# EasyEDA Pro project PicoUSBMotherboardV3.1.eprj, schematic Schematic1
Board Name: Board1; Create Date: 2026-05-29; Page Name: P1; Project Name: PicoUSBMotherboardV3.0; Schematic Name: Schematic1; Update Date: 2026-08-03; Company: EasyEDA.com; Drawn: EasyEDA; Page Size: A4; Part Number: JLCPCB-002; Reviewed: EasyEDA; Version: V0.1
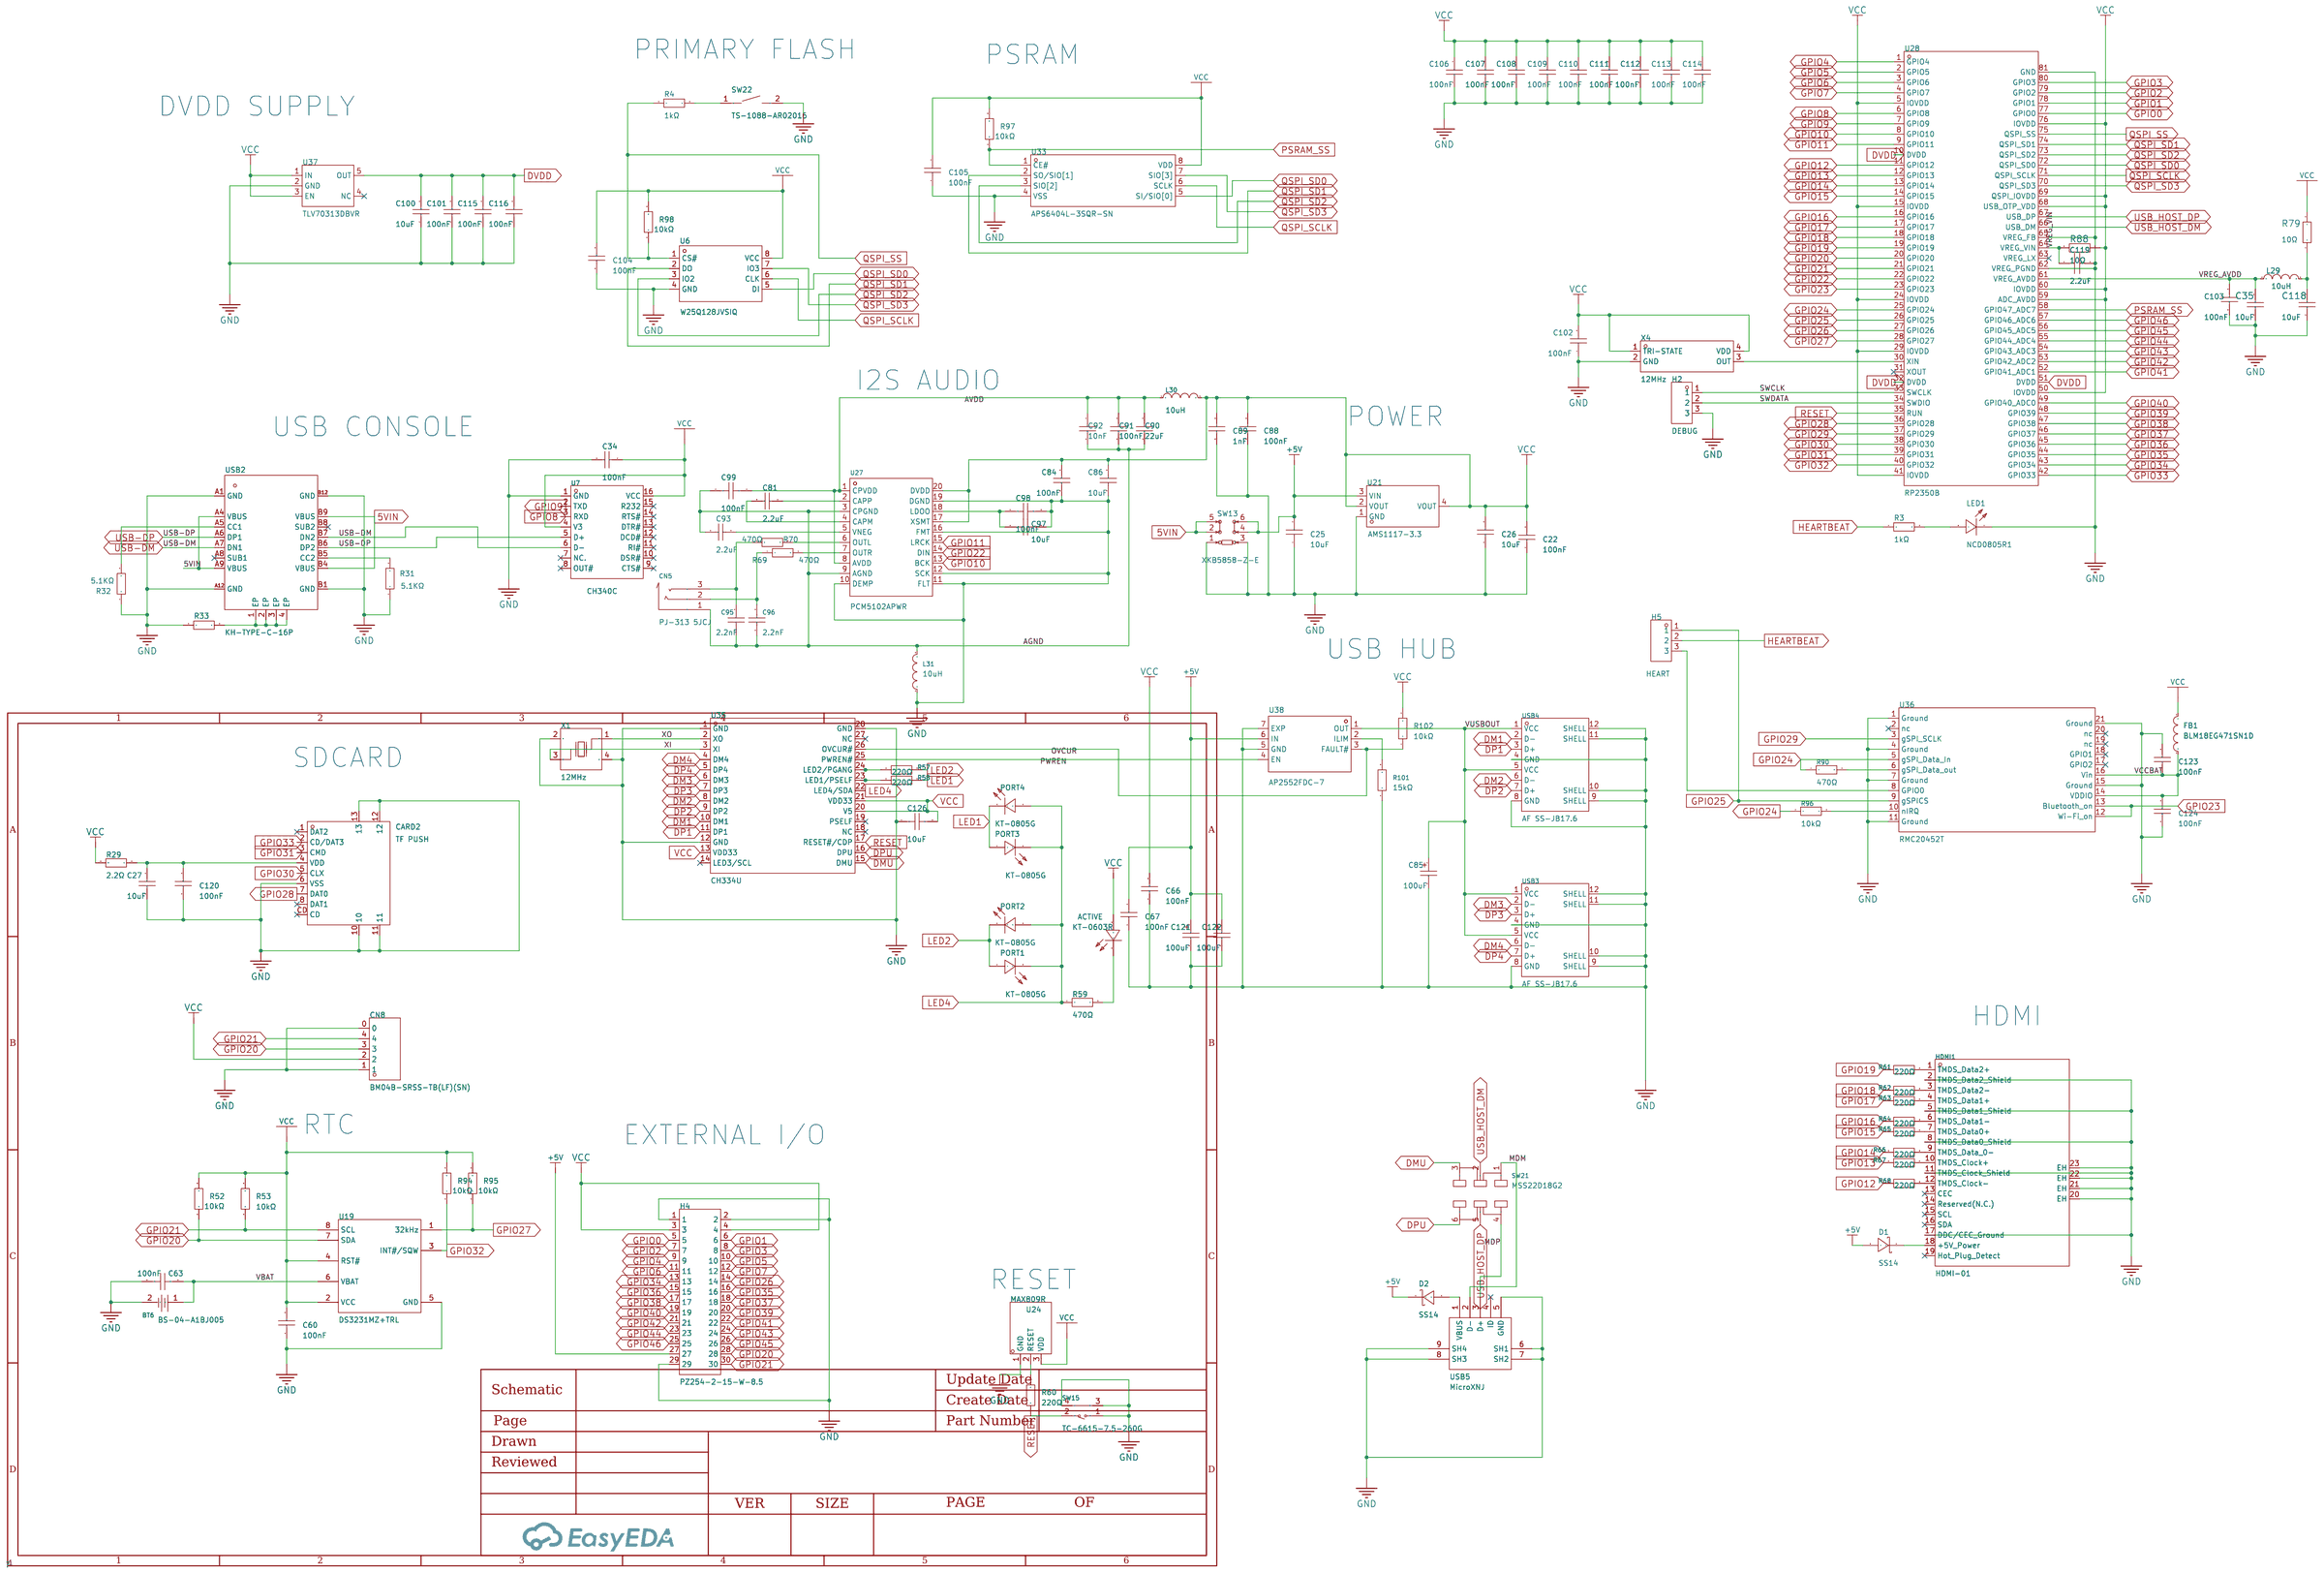
[diagram p0: schematic sheet]

## Parts
ACTIVE  KT-0603R  [LED0603-RD]
BT6  BS-04-A1BJ005  [BAT-TH_BS-04-A1BJ004]
C22  100nF  [C0402_NEW]
C25  10uF  [C1206]
C26  10uF  [C1206]
C27  10uF  [C1206]
C34  100nF  [C0402_NEW]
C35  10uF  [C1206]
C60  100nF  [C0402_NEW]
C63  100nF  [C0402]
C66  100nF  [C0402_NEW]
C67  100nF  [C0402_NEW]
C81  2.2uF  [C0603]
C84  100nF  [C0402_NEW]
C85  100uF  [CASE-B_3528]
C86  10uF  [C1206]
C88  100nF  [C0402_NEW]
C89  1nF  [C0805]
C90  22uF  [C1206]
C91  100nF  [C0402_NEW]
C92  10nF  [C0805]
C93  2.2uF  [C0603]
C95  2.2nF  [C0805]
C96  2.2nF  [C0805]
C97  10uF  [C0805]
C98  100nF  [C0805]
C99  100nF  [C0805]
C100  10uF  [C1206]
C101  100nF  [C0402_NEW]
C102  100nF  [C0402_NEW]
C103  100nF  [C0402_NEW]
C104  100nF  [C0805]
C105  100nF  [C0402_NEW]
C106  100nF  [C0402_NEW]
C107  100nF  [C0402_NEW]
C108  100nF  [C0402_NEW]
C109  100nF  [C0402_NEW]
C110  100nF  [C0402_NEW]
C111  100nF  [C0402_NEW]
C112  100nF  [C0402_NEW]
C113  100nF  [C0402_NEW]
C114  100nF  [C0402_NEW]
C115  100nF  [C0402_NEW]
C116  100nF  [C0402_NEW]
C118  10uF  [C1206]
C119  2.2uF  [C0402]
C120  100nF  [C0805]
C121  100uF  [CASE-B_3528]
C122  100uF  [CASE-B_3528]
C123  100nF  [C0402_NEW]
C124  100nF  [C0402_NEW]
C126  10uF  [C0603]
CARD2  TF PUSH  [TF-SMD_TF-PUSH]
CN5  PJ-313 5JCJ  [AUDIO-TH_PJ-313_5JCJ]
CN8  BM04B-SRSS-TB(LF)(SN)  [CONN-SMD_BM04B-SRSS-TB]
D1  SS14  [SMA_L4.2-W2.6-LS5.3-RD]
D2  SS14  [SMA_L4.2-W2.6-LS5.3-RD]
FB1  BLM18EG471SN1D  [L0603]
H2  DEBUG  [HDR-TH_3P-P2.54-V-M]
H4  PZ254-2-15-W-8.5  [HDR-TH_30P-P2.54-H-M-R2-C15-S2.54-N]
H5  HEART  [HDR-TH_3P-P2.54-V-M]
HDMI1  HDMI-01  [USB-SMD_HDMI-01]
L29  10uH  [L0805]
L30  10uH  [L0805]
L31  10uH  [L0805]
LED1  NCD0805R1  [LED0805-RD]
PORT1  KT-0805G  [LED0805-R-RD]
PORT2  KT-0805G  [LED0805-R-RD]
PORT3  KT-0805G  [LED0805-R-RD]
PORT4  KT-0805G  [LED0805-R-RD]
R3  1kΩ  [R0603]
R4  1kΩ  [R0603]
R29  2.2Ω  [R0805]
R31  5.1kΩ  [R0402]
R32  5.1kΩ  [R0402]
R33  1MΩ  [R0402]
R52  10kΩ  [R0805]
R53  10kΩ  [R0805]
R57  220Ω  [R0805]
R58  220Ω  [R0805]
R59  470Ω  [R0603]
R60  220Ω  [R0603]
R61  220Ω  [R0603]
R62  220Ω  [R0603]
R63  220Ω  [R0603]
R64  220Ω  [R0603]
R65  220Ω  [R0603]
R66  220Ω  [R0603]
R67  220Ω  [R0603]
R68  220Ω  [R0603]
R69  470Ω  [R0603]
R70  470Ω  [R0603]
R79  10Ω  [R0805_NEW]
R88  10Ω  [R0805_NEW]
R90  470Ω  [R0402]
R94  10kΩ  [R0805]
R95  10kΩ  [R0805]
R96  10kΩ  [R0603]
R97  10kΩ  [R0805]
R98  10kΩ  [R0805]
R101  15kΩ  [R0402]
R102  10kΩ  [R0805]
SW13  XKB5858-Z-E  [SW-TH_XKB5858-Z-E]
SW15  TC-6615-7.5-260G  [SW-TH_4P-L7.5-W7.5-P4.50]
SW21  MSS22D18G2  [SW-TH_MSS22D18GX]
SW22  TS-1088-AR02016  [SW-SMD_L3.9-W3.0-P4.45]
U6  W25Q128JVSIQ  [SOIC-8_L5.3-W5.3-P1.27-LS8.0-BL]
U7  CH340C  [SOP-16_L10.0-W3.9-P1.27-LS6.0-BL]
U19  DS3231MZ+TRL  [SOIC-8_L4.9-W3.9-P1.27-LS6.0-BL]
U21  AMS1117-3.3  [SOT-223-3_L6.5-W3.4-P2.30-LS7.0-BR]
U24  MAX809R  [SOT-23-3_L2.9-W1.3-P1.90-LS2.4-BR]
U27  PCM5102APWR  [TSSOP-20_L6.5-W4.4-P0.65-LS6.4-BL]
U28  RP2350B  [QFN-80_L10.0-W10.0-P0.40-TL-EP3.4]
U33  APS6404L-3SQR-SN  [SOIC-8_L4.9-W3.9-P1.27-LS6.0-BL]
U35  CH334U  [QSOP-28_L9.9-W3.9-P0.64-LS6.0-BL]
U36  RMC20452T  [WIRELM-SMD_RMC20452T]
U37  TLV70313DBVR  [SOT-23-5_L3.0-W1.5-P0.95-LS2.8-BL]
U38  AP2552FDC-7  [WDFN-6_L2.0-W2.0-P0.65-BL-EP-1]
USB2  KH-TYPE-C-16P  [USB-C-SMD_KH-TYPE-C-16P]
USB3  AF SS-JB17.6  [USB-A-TH_AF-SS-JB17.6]
USB4  AF SS-JB17.6  [USB-A-TH_AF-SS-JB17.6]
USB5  MicroXNJ  [MICRO-USB-SMD_MICROXNJ]
X1  12MHz  [OSC-SMD_4P-L3.2-W2.5-BL]
X4  12MHz  [OSC-SMD_4P-L3.2-W2.5-BL]

## Library data of the parts
ACTIVE = KT-0603R: Emitted Color:Red Power Dissipation:- Forward Current:- Dominant Wavelength:- Dominant Wavelength:- Peak Wavelength:- Diode Configuration:- Lens Color:- Color Temperature:- Color Temperature:- Viewing Angle:- Mounting Sytle:- Operating Temperature:-40℃~+8; LCSC Part Name: 0603 红灯 高亮; Supplier Part: C2286; Manufacturer: KENTO; Supplier Footprint: 0603; JLCPCB Part Class: Basic Part; Datasheet: https://atta.szlcsc.com/upload/public/pdf/source/20160616/1466072038404.pdf; Supplier: LCSC; Emitted Color: Red; Operating Temperature: -40℃~+85℃
BT6 = BS-04-A1BJ005: Connector Type:Battery base Battery Type:CR2032 Operating Temperature Range:-25℃~+85℃ Operating Temperature Range:-25℃~+85℃; LCSC Part Name: 电池底座 适用电池:CR2032; Supplier Part: C964751; Manufacturer: MYOUNG(美阳); Supplier Footprint: 插件; JLCPCB Part Class: Extended Part; Datasheet: https://atta.szlcsc.com/upload/public/pdf/source/20201218/C964751_974D973689E162B6ACD63DB51B9F9202.pdf; Supplier: LCSC; Connector Type: Battery base; Battery Type: CR2032; Operating Temperature Range: -25℃~+85℃
C22 C34 C60 C66 C67 C84 C88 C91 C101-C103 C105-C116 C123 C124 = CL05B104KO5NNNC: Capacitance: Tolerance:±10% Tolerance:±10% Voltage Rated: Temperature Coefficient:; LCSC Part Name: 100nF ±10% 16V; Supplier Part: C1525; Manufacturer: SAMSUNG(三星); Supplier Footprint: 0402; JLCPCB Part Class: Basic Part; Datasheet: https://atta.szlcsc.com/upload/public/pdf/source/20160103/1457707674891.pdf; Supplier: LCSC; Tolerance: ±10%
C25-C27 C35 C86 C100 C118 = CL31A106KBHNNNE: Capacitance: Tolerance:±10% Tolerance:±10% Voltage Rated: Temperature Coefficient:; LCSC Part Name: 10uF ±10% 50V; Supplier Part: C13585; Manufacturer: SAMSUNG(三星); Supplier Footprint: 1206; JLCPCB Part Class: Basic Part; Datasheet: https://atta.szlcsc.com/upload/public/pdf/source/20160103/1457707668742.pdf; Supplier: LCSC; Tolerance: ±10%
C63 = CL05B104KB54PNC: Capacitance: Tolerance:±10% Tolerance:±10% Voltage Rated: Temperature Coefficient:; LCSC Part Name: 100nF ±10% 50V; Supplier Part: C307331; Manufacturer: SAMSUNG(三星); Supplier Footprint: 0402; JLCPCB Part Class: Basic Part; Datasheet: https://atta.szlcsc.com/upload/public/pdf/source/20160218/1457707763339.pdf; Supplier: LCSC; Tolerance: ±10%
C81 C93 = CL10A225KO8NNNC: Capacitance: Tolerance:±10% Tolerance:±10% Voltage Rated: Temperature Coefficient:; LCSC Part Name: 2.2uF ±10% 16V; Supplier Part: C23630; Manufacturer: SAMSUNG(三星); Supplier Footprint: 0603; JLCPCB Part Class: Basic Part; Datasheet: https://atta.szlcsc.com/upload/public/pdf/source/20160218/1457707763339.pdf; Supplier: LCSC; Tolerance: ±10%
C85 C121 C122 = TAJB107K006RNJ: Capacitance: Tolerance:±10% Tolerance:±10% Rated Voltage: Equivalent Series Resistance(ESR):1.7Ω@100kHz Operating Temperature:-55℃~+125℃ Operating Temperature:-55℃~+125℃; LCSC Part Name: 100uF ±10% 6.3V; Supplier Part: C16133; Manufacturer: Kyocera AVX; Supplier Footprint: CASE-B-3528-21(mm); JLCPCB Part Class: Basic Part; Datasheet: https://atta.szlcsc.com/upload/public/pdf/source/20160107/1457707750344.pdf; Supplier: LCSC; Tolerance: ±10%; Equivalent Series Resistance(ESR): 1.7Ω@100kHz; Operating Temperature: -55℃~+125℃
C89 = CL21B102KBCNNNC: Capacitance: Tolerance:±10% Tolerance:±10% Voltage Rated: Temperature Coefficient:; LCSC Part Name: 1nF ±10% 50V; Supplier Part: C46653; Manufacturer: SAMSUNG(三星); Supplier Footprint: 0805; JLCPCB Part Class: Basic Part; Datasheet: https://atta.szlcsc.com/upload/public/pdf/source/20160218/1457707763339.pdf; Supplier: LCSC; Tolerance: ±10%
C90 = CL31A226KAHNNNE: Capacitance: Tolerance:±10% Tolerance:±10% Voltage Rated: Temperature Coefficient:; LCSC Part Name: 22uF ±10% 25V; Supplier Part: C12891; Manufacturer: SAMSUNG(三星); Supplier Footprint: 1206; JLCPCB Part Class: Basic Part; Datasheet: https://atta.szlcsc.com/upload/public/pdf/source/20160218/1457707763339.pdf; Supplier: LCSC; Tolerance: ±10%
C92 = CL21B103KBANNNC: Capacitance: Tolerance:±10% Tolerance:±10% Voltage Rated: Temperature Coefficient:; LCSC Part Name: 10nF ±10% 50V; Supplier Part: C1710; Manufacturer: SAMSUNG(三星); Supplier Footprint: 0805; JLCPCB Part Class: Basic Part; Datasheet: https://atta.szlcsc.com/upload/public/pdf/source/20160218/1457707763339.pdf; Supplier: LCSC; Tolerance: ±10%
C95 C96 = CL21C222JBFNNNE: Capacitance: Tolerance:±5% Tolerance:±5% Voltage Rated: Temperature Coefficient:; LCSC Part Name: 2.2nF ±5% 50V; Supplier Part: C28260; Manufacturer: SAMSUNG(三星); Supplier Footprint: 0805; JLCPCB Part Class: Basic Part; Datasheet: https://atta.szlcsc.com/upload/public/pdf/source/20160218/1457707763339.pdf; Supplier: LCSC; Tolerance: ±5%
C97 = CL21A106KAYNNNE_C15850: Capacitance: Tolerance:±10% Tolerance:±10% Voltage Rated: Temperature Coefficient:; LCSC Part Name: 10uF ±10% 25V; Supplier Part: C15850; Manufacturer: SAMSUNG(三星); Manufacturer Part: CL21A106KAYNNNE; Supplier Footprint: 0805; JLCPCB Part Class: Basic Part; Datasheet: https://atta.szlcsc.com/upload/public/pdf/source/20160218/1457707763339.pdf; Supplier: LCSC; Tolerance: ±10%
C98 C99 = CC0805KRX7R9BB104: Capacitance: Tolerance:±10% Tolerance:±10% Voltage Rated: Temperature Coefficient:; LCSC Part Name: 100nF ±10% 50V; Supplier Part: C49678; Manufacturer: YAGEO(国巨); Supplier Footprint: 0805; JLCPCB Part Class: Basic Part; Datasheet: https://atta.szlcsc.com/upload/public/pdf/source/20180224/C181747_15194369449651363981.pdf; Supplier: LCSC; Tolerance: ±10%
C104 C120 = CL21B104KCFNNNE: Capacitance: Tolerance:±10% Tolerance:±10% Voltage Rated: Temperature Coefficient:; LCSC Part Name: 100nF ±10% 100V; Supplier Part: C28233; Manufacturer: SAMSUNG(三星); Supplier Footprint: 0805; JLCPCB Part Class: Basic Part; Datasheet: https://atta.szlcsc.com/upload/public/pdf/source/20160218/1457707763339.pdf; Supplier: LCSC; Tolerance: ±10%
C119 = CL05A225MQ5NSNC: Capacitance: Tolerance:±20% Tolerance:±20% Voltage Rated: Temperature Coefficient:; LCSC Part Name: 2.2uF ±20% 6.3V; Supplier Part: C12530; Manufacturer: SAMSUNG(三星); Supplier Footprint: 0402; JLCPCB Part Class: Basic Part; Datasheet: https://atta.szlcsc.com/upload/public/pdf/source/20160218/1457707763339.pdf; Supplier: LCSC; Tolerance: ±20%
C126 = CL10A106KP8NNNC: LCSC Part Name: 10uF ±10% 10V; Supplier Part: C19702; Manufacturer: SAMSUNG(三星); Supplier Footprint: 0603; JLCPCB Part Class: Basic Part; Datasheet: https://item.szlcsc.com/datasheet/CL10A106KP8NNNC/20411.html; Supplier: LCSC; Tolerance: ±10%; Voltage Rating: 10V; Temperature Coefficient: X5R
CARD2 = TF PUSH: Card Type:MicroSD卡(TF卡) Connector Type:卡座 Card Connection Mode:自弹式 Maximum Body Height:2mm Operating Temperature Range:-20℃~+90℃ Operating Temperature Range:-20℃~+90℃; LCSC Part Name: 自弹式TF卡座 TF外焊式内存卡卡座; Supplier Part: C393941; Manufacturer: SHOU HAN(首韩); Supplier Footprint: SMD; JLCPCB Part Class: Extended Part; Datasheet: https://atta.szlcsc.com/upload/public/pdf/source/20191011/C393941_0DDD896EE907FEB750D8B7B8982E2A67.pdf; Supplier: LCSC; Card Type: MicroSD卡(TF卡); Connector Type: 卡座; Card Connection Mode: 自弹式; Maximum Body Height: 2mm; Operating Temperature Range: -20℃~+90℃
CN5 = PJ-313 5JCJ: Connector Type:3.5mm耳机座 Current Rating (Max):- Voltage Rating (Max):- Operating Temperature Range:-20℃~+70℃ Operating Temperature Range:-20℃~+70℃; LCSC Part Name: 3.5mm耳机座; Supplier Part: C668607; Manufacturer: SHOU HAN(首韩); Supplier Footprint: 插件; JLCPCB Part Class: Extended Part; Datasheet: https://atta.szlcsc.com/upload/public/pdf/source/20200618/C668607_FE17687B176711313D54B567644D1F03.pdf; Supplier: LCSC; Connector Type: 3.5mm耳机座; Operating Temperature Range: -20℃~+70℃
CN8 = BM04B-SRSS-TB(LF)(SN): Pins Structure:1x4P Pitch:1mm Mounting Style:Standing paste Reference Series:SH Number of Pins:4P Number of Rows:1 Number of PINs Per Row:4 Row Spacing:- Current Rating (Max):1A Contact Material:Copper alloy Contact Plating:Tin Operating Temperature Range; LCSC Part Name: 1x4P 间距:1mm 立贴 系列:SH; Supplier Part: C160390; Manufacturer: JST; Supplier Footprint: SMD,P=1mm; JLCPCB Part Class: Extended Part; Datasheet: https://atta.szlcsc.com/upload/public/pdf/source/20181008/C268118_5C0FE2784716D1E5DD0A36233D1E1F34.pdf; Supplier: LCSC; Pins Structure: 1x4P; Pitch: 1mm; Mounting Style: Standing paste; Reference Series: SH; Number of Pins: 4P; Number of Rows: 1; Number of PINs Per Row: 4; Current Rating (Max): 1A; Contact Material: Copper alloy; Contact Plating: Tin; Operating Temperature Range: -25℃~+85℃; Rated Voltage (Max): 50V; Plastic Material: PA; Flame Retardant Rating: UL94V-0; Supplementary Features: Auxiliary soldering legs; Colour: White; Z-Height of the Board: 4.25mm; X-Length of Bottom Edge on Board (Spacing Line): 6mm; Y-Width of Bottom Edge on Board: 3.6mm
D1 D2 = SS14_C2480: Diode Configuration:Single Forward Voltage (Vf@If):550mV@1A Reverse Voltage (Vr):40V Rectified Current:1A Reverse Leakage Current (Ir):300uA@40V; LCSC Part Name: 电压:40V 电流:1A; Supplier Part: C2480; Manufacturer: MDD(辰达半导体); Supplier Footprint: SMA(DO-214AC); JLCPCB Part Class: Basic Part; Datasheet: https://atta.szlcsc.com/upload/public/pdf/source/20230712/2DB6064CFBB99DE6DB116BEE8208BE66.pdf; Supplier: LCSC; Diode Configuration: Single; Forward Voltage (Vf@If): 550mV@1A; Reverse Voltage (Vr): 40V; Rectified Current: 1A; Reverse Leakage Current (Ir): 300uA@40V
FB1 = BLM18EG471SN1D: Impedance @ Frequency:470Ω@100MHz Tolerance:±25% Tolerance:±25% DC Resistance(DCR):210mΩ Current Rating:500mA Number of Circuits:1 Operating Temperature:-55℃~+125℃ Operating Temperature:-55℃~+125℃; LCSC Part Name: 单路 0603磁珠 阻抗470Ω@100MHz; Supplier Part: C337880; Manufacturer: muRata(村田); Supplier Footprint: 0603; JLCPCB Part Class: Extended Part; Datasheet: https://item.szlcsc.com/datasheet/BLM18EG471SN1D/315660.html; Supplier: LCSC; Impedance @ Frequency: 470Ω@100MHz; Tolerance: ±25%; DC Resistance(DCR): 210mΩ; Current Rating: 500mA; Number of Circuits: 1; Operating Temperature: -55℃~+125℃
H2 H5 = PZ254V-11-03P: Pin Structure:1x3P Pitch:2.54mm Row Spacing:- Circluar Pins/Square Pins:Policy Mounting Type:Direct Insert Number of Rows:Single Row Number of Pins:3P Current Rating (Max):3A Voltage Rating (Max):250V Length of Mating Pin:6mm Insulation Height:2.5mm Lengt; LCSC Part Name: 间距:2.54mm 1x3P 直插 方针; Supplier Part: C2937625; Manufacturer: XFCN(兴飞); Supplier Footprint: 插件,P=2.54mm; JLCPCB Part Class: Extended Part; Datasheet: https://atta.szlcsc.com/upload/public/pdf/source/20200309/C492402_8335C3D49C4E4C618838D59BB1D024C1.pdf; Supplier: LCSC; Pin Structure: 1x3P; Pitch: 2.54mm; Circluar Pins/Square Pins: Policy; Mounting Type: Direct Insert; Number of Rows: Single Row; Number of Pins: 3P; Current Rating (Max): 3A; Voltage Rating (Max): 250V; Length of Mating Pin: 6mm; Insulation Height: 2.5mm; Length of End Connection Pin: 3mm; Operating Temperature Range: -40℃~+105℃; Color: Black
H4 = PZ254-2-15-W-8.5: Pin Structure:2x15P Pitch:2.54mm Row Spacing:2.54mm Circluar Pins/Square Pins:Policy Mounting Type:Right-Angle Number of Rows:Double Row Number of Pins:30P Current Rating:3A Voltage Rating (Max):- Length of Mating Pin:6mm Insulation Height:2.5mm Length of; LCSC Part Name: 2x15P 间距:2.54mm 方针 弯插; Supplier Part: C2894995; Manufacturer: HCTL(华灿天禄); Supplier Footprint: 弯插,P=2.54mm; JLCPCB Part Class: Extended Part; Datasheet: https://atta.szlcsc.com/upload/public/pdf/source/20230609/1B60364E488FD8696AA7206A46578DEA.pdf; Supplier: LCSC; Pin Structure: 2x15P; Pitch: 2.54mm; Row Spacing: 2.54mm; Circluar Pins/Square Pins: Policy; Mounting Type: Right-Angle; Number of Rows: Double Row; Number of Pins: 30P; Current Rating: 3A; Length of Mating Pin: 6mm; Insulation Height: 2.5mm; Operating Temperature: -40℃~+105℃; Color: Black
HDMI1 = HDMI-01: Connector Type:HDMI Gender:Female Number of Pins:19P Mounting Style:卧贴 Number of Rows:- Current Rating (Max):- Operating Temperature Range:- Operating Temperature Range:-; LCSC Part Name: HDMI 母 P数:19P; Supplier Part: C2906135; Manufacturer: HCTL(华灿天禄); Supplier Footprint: SMD; JLCPCB Part Class: Extended Part; Datasheet: https://atta.szlcsc.com/upload/public/pdf/source/20211027/174AF3D22F1FA530D4E3857278AECDA6.pdf; Supplier: LCSC; Connector Type: HDMI; Gender: Female; Number of Pins: 19P; Mounting Style: 卧贴
L29 = SDFL2012S100KTF: Inductance: Tolerance:±10% Tolerance:±10% Rated Current: Saturation Current (Isat):- DC Resistance (DCR): Q @ Freq:- Frequency - Self Resonant:- Ratings:; LCSC Part Name: 10uH ±10%; Supplier Part: C1046; Manufacturer: Sunlord(顺络); Supplier Footprint: 0805; JLCPCB Part Class: Basic Part; Datasheet: https://atta.szlcsc.com/upload/public/pdf/source/20231027/097A17DDB71564CE812E62F0F80142C9.pdf; Supplier: LCSC; Tolerance: ±10%
L30 L31 = MLZ2012M100HT000: LCSC Part Name: 10uH ±20% 200mA; Supplier Part: C88172; Manufacturer: TDK; Supplier Footprint: 0805; JLCPCB Part Class: Extended Part; Datasheet: https://item.szlcsc.com/datasheet/MLZ2012M100HT000/89350.html; Supplier: LCSC; Tolerance: ±20%; Current - Saturation (Isat): 200mA; DC Resistance(DCR): 680mΩ
LED1 = NCD0805R1_C84256: Emitted Color:红灯; LCSC Part Name: 红灯; Supplier Part: C84256; Manufacturer: 国星光电; Supplier Footprint: 0805; JLCPCB Part Class: Basic Part; Datasheet: https://atta.szlcsc.com/upload/public/pdf/source/20200820/C84256_F0A75A43B3EAD75808600A0514C76B99.pdf; Supplier: LCSC; Emitted Color: 红灯
PORT1-PORT4 = KT-0805G: Lamp Holder Type:- Emitted Color:Emerald Forward Voltage (VF):- Forward Voltage (VF):- Power Dissipation:- Forward Current:- Dominant Wavelength:- Dominant Wavelength:- Peak Wavelength:- Diode Configuration:- Lens Color:- Color Temperature:- Color Tempera; LCSC Part Name: 0805 翠绿 高亮; Supplier Part: C2297; Manufacturer: KENTO; Supplier Footprint: 0805; JLCPCB Part Class: Basic Part; Datasheet: https://atta.szlcsc.com/upload/public/pdf/source/20170209/1486607340485.pdf; Supplier: LCSC; Emitted Color: Emerald
R3 R4 = 0603WAF1001T5E: Type:Thick Film Resistors Resistance: Tolerance:±1% Tolerance:±1% Power(Watts): Temperature Coefficient:±100ppm/℃ Temperature Coefficient:±100ppm/℃ Overload Voltage (Max): Operating Temperature Range:-55℃~+155℃ Operating Temperature Range:-55℃~+155℃; LCSC Part Name: 1kΩ ±1% 100mW; Supplier Part: C21190; Manufacturer: UNI-ROYAL(厚声); Supplier Footprint: 0603; JLCPCB Part Class: Basic Part; Datasheet: https://atta.szlcsc.com/upload/public/pdf/source/20200306/C422600_1E6D84923E4A46A82E41ADD87F860B5C.pdf; Supplier: LCSC; Type: Thick Film Resistors; Tolerance: ±1%; Temperature Coefficient: ±100ppm/℃; Operating Temperature Range: -55℃~+155℃
R29 = 0805W8F220KT5E: LCSC Part Name: 2.2Ω(2R20) ±1% 编带; Supplier Part: C17521; Manufacturer: UNI-ROYAL(厚声); Supplier Footprint: 0805; JLCPCB Part Class: Basic Part; Datasheet: https://atta.szlcsc.com/upload/public/pdf/source/20170920/C17521_1505887118343979880.pdf; Supplier: LCSC
R31 R32 = 0402WGF5101TCE: Type:Thick Film Resistors Resistance: Tolerance:±1% Tolerance:±1% Power(Watts): Temperature Coefficient:±100ppm/℃ Temperature Coefficient:±100ppm/℃ Overload Voltage (Max): Operating Temperature Range:-55℃~+155℃ Operating Temperature Range:-55℃~+155℃; LCSC Part Name: 5.1KΩ(5101) ±1% 编带; Supplier Part: C25905; Manufacturer: UNI-ROYAL(厚声); Manufacturer Part: 5.1KΩ; Supplier Footprint: 0402; JLCPCB Part Class: Basic Part; Datasheet: https://atta.szlcsc.com/upload/public/pdf/source/20170920/C25905_1505895107382980911.pdf; Supplier: LCSC; Type: Thick Film Resistors; Tolerance: ±1%; Temperature Coefficient: ±100ppm/℃; Operating Temperature Range: -55℃~+155℃
R33 = 0402WGF1004TCE: Type:Thick Film Resistors Resistance: Tolerance:±1% Tolerance:±1% Power(Watts): Temperature Coefficient:±100ppm/℃ Temperature Coefficient:±100ppm/℃ Overload Voltage (Max): Operating Temperature Range:-55℃~+155℃ Operating Temperature Range:-55℃~+155℃; LCSC Part Name: 1MΩ ±1% 62.5mW; Supplier Part: C26083; Manufacturer: UNI-ROYAL(厚声); Supplier Footprint: 0402; JLCPCB Part Class: Basic Part; Datasheet: https://atta.szlcsc.com/upload/public/pdf/source/20200306/C422600_1E6D84923E4A46A82E41ADD87F860B5C.pdf; Supplier: LCSC; Type: Thick Film Resistors; Tolerance: ±1%; Temperature Coefficient: ±100ppm/℃; Operating Temperature Range: -55℃~+155℃
R52 R53 R94 R95 R97 R98 R102 = 0805W8F1002T5E: Type:Thick Film Resistors Resistance: Tolerance:±1% Tolerance:±1% Power(Watts): Temperature Coefficient:±100ppm/℃ Temperature Coefficient:±100ppm/℃ Overload Voltage (Max): Operating Temperature Range:-55℃~+155℃ Operating Temperature Range:-55℃~+155℃; LCSC Part Name: 10kΩ ±1% 125mW; Supplier Part: C17414; Manufacturer: UNI-ROYAL(厚声); Supplier Footprint: 0805; JLCPCB Part Class: Basic Part; Datasheet: https://atta.szlcsc.com/upload/public/pdf/source/20200306/C422600_1E6D84923E4A46A82E41ADD87F860B5C.pdf; Supplier: LCSC; Type: Thick Film Resistors; Tolerance: ±1%; Temperature Coefficient: ±100ppm/℃; Operating Temperature Range: -55℃~+155℃
R57 R58 = 0805W8F2200T5E: Type:Thick Film Resistors Resistance: Tolerance:±1% Tolerance:±1% Power(Watts): Overload Voltage (Max): Temperature Coefficient:±100ppm/℃ Temperature Coefficient:±100ppm/℃ Operating Temperature Range:-55℃~+155℃ Operating Temperature Range:-55℃~+155℃; LCSC Part Name: 220Ω ±1% 125mW 厚膜电阻; Supplier Part: C17557; Manufacturer: UNI-ROYAL(厚声); Supplier Footprint: 0805; JLCPCB Part Class: Basic Part; Datasheet: https://atta.szlcsc.com/upload/public/pdf/source/20200306/C422600_1E6D84923E4A46A82E41ADD87F860B5C.pdf; Supplier: LCSC; Type: Thick Film Resistors; Tolerance: ±1%; Temperature Coefficient: ±100ppm/℃; Operating Temperature Range: -55℃~+155℃
R59 R69 R70 = 0603WAF4700T5E: Type:Thick Film Resistors Resistance: Tolerance:±1% Tolerance:±1% Power(Watts): Overload Voltage (Max): Temperature Coefficient:±100ppm/℃ Temperature Coefficient:±100ppm/℃ Operating Temperature Range:-55℃~+155℃ Operating Temperature Range:-55℃~+155℃; LCSC Part Name: 470Ω ±1% 100mW 厚膜电阻; Supplier Part: C23179; Manufacturer: UNI-ROYAL(厚声); Supplier Footprint: 0603; JLCPCB Part Class: Basic Part; Datasheet: https://atta.szlcsc.com/upload/public/pdf/source/20200306/C422600_1E6D84923E4A46A82E41ADD87F860B5C.pdf; Supplier: LCSC; Type: Thick Film Resistors; Tolerance: ±1%; Temperature Coefficient: ±100ppm/℃; Operating Temperature Range: -55℃~+155℃
R60-R68 = 0603WAF2200T5E: Type:Thick Film Resistors Resistance: Tolerance:±1% Tolerance:±1% Power(Watts): Temperature Coefficient:±100ppm/℃ Temperature Coefficient:±100ppm/℃ Overload Voltage (Max): Operating Temperature Range:-55℃~+155℃ Operating Temperature Range:-55℃~+155℃; LCSC Part Name: 220Ω ±1% 100mW; Supplier Part: C22962; Manufacturer: UNI-ROYAL(厚声); Supplier Footprint: 0603; JLCPCB Part Class: Basic Part; Datasheet: https://atta.szlcsc.com/upload/public/pdf/source/20200306/C422600_1E6D84923E4A46A82E41ADD87F860B5C.pdf; Supplier: LCSC; Type: Thick Film Resistors; Tolerance: ±1%; Temperature Coefficient: ±100ppm/℃; Operating Temperature Range: -55℃~+155℃
R79 R88 = 0805W8F100JT5E: Type:Thick Film Resistors Resistance:10Ω Tolerance:±1% Tolerance:±1% Power(Watts): Overload Voltage (Max): Temperature Coefficient:±200ppm/℃ Temperature Coefficient:±200ppm/℃ Operating Temperature Range:-55℃~+155℃ Operating Temperature Range:-55℃~+155℃; LCSC Part Name: 10Ω ±1% 125mW 厚膜电阻; Supplier Part: C17415; Manufacturer: UNI-ROYAL(厚声); Supplier Footprint: 0805; JLCPCB Part Class: Basic Part; Datasheet: https://atta.szlcsc.com/upload/public/pdf/source/20200306/C422600_1E6D84923E4A46A82E41ADD87F860B5C.pdf; Supplier: LCSC; Type: Thick Film Resistors; Tolerance: ±1%; Temperature Coefficient: ±200ppm/℃; Operating Temperature Range: -55℃~+155℃
R90 = 0402WGF4700TCE: Type:Thick Film Resistor Resistance:470Ω Tolerance:±1% Tolerance:±1% Power(Watts):62.5mW Voltage-Supply(Max):50V Temperature Coefficient:±100ppm/℃ Temperature Coefficient:±100ppm/℃ Operating Temperature:-55℃~+155℃ Operating Temperature:-55℃~+155℃; LCSC Part Name: 470Ω ±1% 62.5mW 厚膜电阻; Supplier Part: C25117; Manufacturer: UNI-ROYAL(厚声); Supplier Footprint: 0402; JLCPCB Part Class: Basic Part; Datasheet: https://item.szlcsc.com/datasheet/0402WGF4700TCE/25860.html; Supplier: LCSC; Type: Thick Film Resistor; Tolerance: ±1%; Power(Watts): 62.5mW; Voltage-Supply(Max): 50V; Temperature Coefficient: ±100ppm/℃; Operating Temperature: -55℃~+155℃
R96 = 0603WAF1002T5E: Type:Thick Film Resistors Resistance:10kΩ Tolerance:±1% Tolerance:±1% Power(Watts): Overload Voltage (Max): Temperature Coefficient:±100ppm/℃ Temperature Coefficient:±100ppm/℃ Operating Temperature Range:-55℃~+155℃ Operating Temperature Range:-55℃~+155℃; LCSC Part Name: 厚膜电阻 10kΩ ±1% 100mW; Supplier Part: C25804; Manufacturer: UNI-ROYAL(厚声); Supplier Footprint: 0603; JLCPCB Part Class: Basic Part; Datasheet: https://atta.szlcsc.com/upload/public/pdf/source/20200306/C422600_1E6D84923E4A46A82E41ADD87F860B5C.pdf; Supplier: LCSC; Type: Thick Film Resistors; Tolerance: ±1%; Temperature Coefficient: ±100ppm/℃; Operating Temperature Range: -55℃~+155℃
R101 = 0402WGF1502TCE: LCSC Part Name: 15kΩ ±1% 62.5mW 厚膜电阻; Supplier Part: C25756; Manufacturer: UNI-ROYAL(厚声); Supplier Footprint: 0402; JLCPCB Part Class: Basic Part; Datasheet: https://atta.szlcsc.com/upload/public/pdf/source/20200306/C422600_1E6D84923E4A46A82E41ADD87F860B5C.pdf; Supplier: LCSC; Type: Thick Film Resistors; Tolerance: ±1%; Temperature Coefficient: ±100ppm/℃; Operating Temperature Range: -55℃~+155℃
SW13 = XKB5858-Z-E: Contact Current:100mA Voltage Rating (AC):250V Voltage Rating (DC):30V Insulation Resistance:100MΩ Mounting Style:Lying Self Lock / No Lock:LATCHING Actuator Style:Square Plunger Actuator/Cap Color:White With Lamp:No Pin Style:PCPin Operating Force:250gf@; Supplier Part: C780038; Manufacturer: XKB Connectivity(中国星坤); Supplier Footprint: 插件; JLCPCB Part Class: Extended Part; Datasheet: https://atta.szlcsc.com/upload/public/pdf/source/20211011/56D3FA9FC185EAC41365C3B37B684CC1.pdf; Supplier: LCSC; Contact Current: 100mA; Voltage Rating (AC): 250V; Voltage Rating (DC): 30V; Insulation Resistance: 100MΩ; Mounting Style: Lying; Self Lock / No Lock: LATCHING; Actuator Style: Square Plunger; Actuator/Cap Color: White; With Lamp: No; Pin Style: PCPin; Operating Force: 250gf@±50gf; Operating Temperature: -15℃~+55℃; Mechanical Life: 100000
SW15 = TC-6615-7.5-260G: Circuit:SPST Actuator Style:- Operating Force:260gf Mounting Style:Lying Switch Length:6mm Switch Width:6mm Switch Height:7.5mm Strike Gundam:带支架 Contact Current:50mA Voltage Rating (AC):- Voltage Rating (DC):12V Power Rating:- Insulation Resistance:- Act; LCSC Part Name: 轻触6*6*7.5支架 插件260g; Supplier Part: C2845276; Manufacturer: HCTL(华灿天禄); Supplier Footprint: 插件; JLCPCB Part Class: Extended Part; Datasheet: https://atta.szlcsc.com/upload/public/pdf/source/20230523/3B07ECEFF69432C539FEAF1B55455C52.pdf; Supplier: LCSC; Circuit: SPST; Operating Force: 260gf; Mounting Style: Lying; Switch Length: 6mm; Switch Width: 6mm; Switch Height: 7.5mm; Strike Gundam: 带支架; Contact Current: 50mA; Voltage Rating (DC): 12V
SW21 = MSS22D18G2: LCSC Part Name: MSS-22D18G2; Supplier Part: C431542; Manufacturer: SHOU HAN(首韩); Supplier Footprint: 插件-6P,9.1x3.5mm; JLCPCB Part Class: Extended Part; Datasheet: https://item.szlcsc.com/datasheet/MSS22D18G2/427899.html; Supplier: LCSC; Circuit: DPDT; Termination Style: SMD(SMT) Tab; Length: 9.1mm; Width: 3.5mm; Switch Height: 3.5mm; Mounting Type: Through Hole; Current Rating: 100mA; Voltage Rating: 12V; Life: 10,000 cycles; Operating Temperature: -10℃~+50℃
SW22 = TS-1088-AR02016: LCSC Part Name: 4*3*2mm 立贴 轻触开关; Supplier Part: C720477; Manufacturer: XUNPU(讯普); Supplier Footprint: SMD,4x3mm; JLCPCB Part Class: Basic Part; Datasheet: https://item.szlcsc.com/datasheet/TS-1088-AR02016/763484.html; Supplier: LCSC; Circuit: SPST; Actuator Style: Round Button; Operating Force: 1.6N; Mounting Type: Surface Mount,Vertical; Length: 4mm; Width: 3mm; Switch Height: 2mm; with Bracket: Without Bracket; Contact Current: 50mA; Voltage Rating: 12V; Actuator/Cap Color: Black; Termination Style: SMD(SMT) Tab; Life: 100,000 Cycles; Operating Temperature: -30℃~+80℃
U6 = W25Q128JVSIQ: Supplier Part: C97521; Manufacturer: WINBOND(华邦); Supplier Footprint: SOIC-8-208mil; JLCPCB Part Class: Basic Part; Datasheet: https://atta.szlcsc.com/upload/public/pdf/source/20170316/1489627409956.pdf; Supplier: LCSC
U7 = CH340C: Applications Function:Transceiver Protocol: Data Rate:2Mbps Supply Voltage:3.3V；5V Supply Voltage:3.3V；5V; LCSC Part Name: CH340C USB转串口芯片 CH340; Supplier Part: C84681; Manufacturer: WCH(南京沁恒); Supplier Footprint: SOP-16; JLCPCB Part Class: Extended Part; Datasheet: https://atta.szlcsc.com/upload/public/pdf/source/20200819/C84681_ADBED554CE321879DBD6B1D06488689C.pdf; Supplier: LCSC; Applications Function: Transceiver; Data Rate: 2Mbps; Supply Voltage: 3.3V；5V
U19 = DS3231MZ+TRL: Interface:I2C Operating Voltage:2.3V~5.5V Operating Voltage:2.3V~5.5V Operating Temperature:-40℃~+85℃ Operating Temperature:-40℃~+85℃; Supplier Part: C107410; Manufacturer: ADI(亚德诺)/MAXIM(美信); Supplier Footprint: SOIC-8; JLCPCB Part Class: Extended Part; Datasheet: https://atta.szlcsc.com/upload/public/pdf/source/20170620/1497944726830.pdf; Supplier: LCSC; Interface: I2C; Operating Voltage: 2.3V~5.5V; Operating Temperature: -40℃~+85℃
U21 = AMS1117-3.3_C6186: Output Type: Output Polarity:Positive Number of Outputs:1 Maximum Input Voltage:- Output Voltage:3.3V~3.3V Output Voltage:3.3V~3.3V Dropout Voltage:1.3V@(800mA) Quiescent Current (Ground Current):- Output Current:1A Power Supply Rejection Ratio (PSRR):72d; LCSC Part Name: 正 Vout=3.3V 1A 72dB@(120Hz); Supplier Part: C6186; Manufacturer: AMS; Supplier Footprint: SOT-223-3; JLCPCB Part Class: Basic Part; Datasheet: https://atta.szlcsc.com/upload/public/pdf/source/20180727/C6186_7A095716F0823C02F1997A905E26C086.pdf; Supplier: LCSC; Output Polarity: Positive; Number of Outputs: 1; Output Voltage: 3.3V~3.3V; Dropout Voltage: 1.3V@(800mA); Output Current: 1A; Power Supply Rejection Ratio (PSRR): 72dB@(120Hz)
U24 = MAX809R: ChipType:Voltage detector Output Type:推挽 Reset Active Level:低电平有效 Threshold Voltage:2.63V Number of Voltages Monitored:1 Reset Timeout:150ms Operating Temperature:-40℃~+85℃ Operating Temperature:-40℃~+85℃; Supplier Part: C347370; Manufacturer: UMW(友台半导体); Supplier Footprint: SOT-23; JLCPCB Part Class: Extended Part; Datasheet: https://atta.szlcsc.com/upload/public/pdf/source/20231109/70FCB8835B3C4291565001D8791320BC.pdf; Supplier: LCSC; ChipType: Voltage detector; Output Type: 推挽; Reset Active Level: 低电平有效; Threshold Voltage: 2.63V; Number of Voltages Monitored: 1; Reset Timeout: 150ms; Operating Temperature: -40℃~+85℃
U27 = PCM5102APWR: Interface Type:PCM Supply Voltage:1.65V~3.46V Supply Voltage:1.65V~3.46V Number of Channels:2 Resolution:24；16；32 Operating Temperature:-25℃~+85℃ Operating Temperature:-25℃~+85℃; Supplier Part: C107671; Manufacturer: TI(德州仪器); Supplier Footprint: TSSOP-20; JLCPCB Part Class: Extended Part; Datasheet: https://www.ti.com/cn/lit/gpn/pcm5102a; Supplier: LCSC; Interface Type: PCM; Supply Voltage: 1.65V~3.46V; Number of Channels: 2; Resolution: 24；16；32; Operating Temperature: -25℃~+85℃
U28 = RP2350B_C42415655: Supplier Part: C42415655; Manufacturer: Raspberry Pi(树莓派); Supplier Footprint: QFN-80-EP(10x10); JLCPCB Part Class: Extended Part; Datasheet: https://atta.szlcsc.com/upload/public/pdf/source/20241210/0989AB86AAD7A21936E5CD12ADC9EA29.pdf; Supplier: LCSC
U33 = APS6404L-3SQR-SN_C5333729: Supplier Part: C5333729; Manufacturer: Apmemory; Supplier Footprint: SOP-8; JLCPCB Part Class: Extended Part; Datasheet: https://atta.szlcsc.com/upload/public/pdf/source/20230206/47F6F63A2B63C528FEFCE249E0943D90.pdf; Supplier: LCSC
U35 = CH334U: type:Hub Protocol:USB 2.0 Data Rate:480Mbps Supply Voltage:5V；3.3V Supply Voltage:5V；3.3V Operating Temperature:-40℃~+85℃ Operating Temperature:-40℃~+85℃; Supplier Part: C5187524; Manufacturer: WCH(南京沁恒); Supplier Footprint: QSOP-28-150mil; JLCPCB Part Class: Extended Part; Datasheet: https://atta.szlcsc.com/upload/public/pdf/source/20240313/F10102419207E0A8DF436FE155285300.pdf; Supplier: LCSC; type: Hub; Protocol: USB 2.0; Data Rate: 480Mbps; Supply Voltage: 5V；3.3V; Operating Temperature: -40℃~+85℃
U36 = RMC20452T_C49451547: LCSC Part Name: 适用于树莓派微控制器的紧凑型Wi-Fi和蓝牙无线通信模块，具备GPIO扩展选项; Supplier Part: C49451547; Manufacturer: Raspberry Pi(树莓派); Supplier Footprint: SMD,16.5x14.5mm; JLCPCB Part Class: Extended Part; Datasheet: https://item.szlcsc.com/datasheet/RMC20452T/51998224.html; Supplier: LCSC
U37 = TLV70313DBVR: LCSC Part Name: 300mA、高 PSRR、低 IQ、低压降稳压器; Supplier Part: C2868385; Manufacturer: TI(德州仪器); Supplier Footprint: SOT-23-5; JLCPCB Part Class: Extended Part; Datasheet: https://www.ti.com/cn/lit/gpn/tlv703; Supplier: LCSC; Output Type: Fixed; Voltage - Supply: 5.5V; Output Voltage: 1.3V; Output Current: 300mA; Power Supply Rejection Ratio (PSRR): 68dB@(1kHz); Voltage Dropout: 375mV@(300mA); standby current: 55uA; Operating Temperature: -40℃~+125℃@(Tj); Output Configuration: Positive electrode; Number of Outputs: 1
U38 = AP2552FDC-7: LCSC Part Name: 精密可调限流电源开关; Supplier Part: C150475; Manufacturer: DIODES(美台); Supplier Footprint: DFN-6-EP(2x2); JLCPCB Part Class: Extended Part; Datasheet: https://item.szlcsc.com/datasheet/AP2552FDC-7/161813.html; Supplier: LCSC; Type: High Side Switch; Number of Channels: 1; Control Input Logic: Active Low; Maximum Continuous Current: 2.1A; Voltage - Supply: 2.7V~5.5V; RDS(on): 120mΩ; Operating Temperature	-: -40℃~+85℃; Features: Overtemperature protection (OTP)；Short-Circuit  Protection(SCP)；Overcurrent Protection(OCP)
USB2 = KH-TYPE-C-16P: Connector Type:Type-C Standard:- Gender:Female Number of Contacts:16 Number of Ports:1 Mounting Style:Surface Mount Current Rating - Power (Max):3A Operating Temperature Range:-40℃~+85℃ Operating Temperature Range:-40℃~+85℃; LCSC Part Name: Type-C 母座 卧贴; Supplier Part: C709357; Manufacturer: kinghelm(金航标); Supplier Footprint: SMD; JLCPCB Part Class: Extended Part; Datasheet: https://atta.szlcsc.com/upload/public/pdf/source/20200911/C709357_AA8DCEB38BB20E3035A7ED7AE7667837.pdf; Supplier: LCSC; Connector Type: Type-C; Gender: Female; Number of Contacts: 16; Number of Ports: 1; Mounting Style: Surface Mount; Current Rating - Power (Max): 3A; Operating Temperature Range: -40℃~+85℃
USB3 USB4 = AF SS-JB17.6: Connector Type:Type-A Standard:USB 2.0 Gender:Female Number of Ports:2 Number of Contacts:4P+4P Mounting Style:Right-Angle Current Rating - Power (Max):1.5A Operating Temperature Range:-25℃~+85℃ Operating Temperature Range:-25℃~+85℃; LCSC Part Name: Type-A 母 弯插; Supplier Part: C456021; Manufacturer: SHOU HAN(首韩); Supplier Footprint: 插件; JLCPCB Part Class: Extended Part; Datasheet: https://atta.szlcsc.com/upload/public/pdf/source/20191113/C456021_DAD2CFBF46E609FF6653446337360E6B.pdf; Supplier: LCSC; Connector Type: Type-A; Standard: USB 2.0; Gender: Female; Number of Ports: 2; Number of Contacts: 4P+4P; Mounting Style: Right-Angle; Current Rating - Power (Max): 1.5A; Operating Temperature Range: -25℃~+85℃
USB5 = MicroXNJ: Connector Type:Micro-B Standard:USB 2.0 Gender:Female Mounting Style:Horizontal attachment Number of Contacts:5P Number of Ports:1 Current Rating - Power (Max):1.8A Operating Temperature Range:-20℃~+85℃ Operating Temperature Range:-20℃~+85℃ Rated Voltage; LCSC Part Name: Micro-B 母 卧贴; Supplier Part: C404969; Manufacturer: SHOU HAN(首韩); Supplier Footprint: SMD; JLCPCB Part Class: Extended Part; Datasheet: https://atta.szlcsc.com/upload/public/pdf/source/20220415/2494EDFF499AF6F852F7C820374B6AF3.pdf; Supplier: LCSC; Connector Type: Micro-B; Standard: USB 2.0; Gender: Female; Mounting Style: Horizontal attachment; Number of Contacts: 5P; Number of Ports: 1; Current Rating - Power (Max): 1.8A; Operating Temperature Range: -20℃~+85℃; Rated Voltage (Max): 30V; Connect-Disconnect Life: 5000 Cuts; Core Colour: Black
X1 = X322512MSB4SI: Crystal Type:Surface Mount Crystal Frequency: Normal temperature Frequency Tolerance:±10ppm Normal temperature Frequency Tolerance:±10ppm External load capacitor: Frequency Stability(Full temperature range):±20ppm Frequency Stability(Full temperature rang; LCSC Part Name: 12MHz ±10ppm 20pF; Supplier Part: C9002; Manufacturer: YXC(扬兴晶振); Supplier Footprint: SMD3225-4P; JLCPCB Part Class: Basic Part; Datasheet: https://atta.szlcsc.com/upload/public/pdf/source/20240329/19D5F850207469550BEB00D7DFEDBC7A.pdf; Supplier: LCSC; Crystal Type: Surface Mount Crystal; Normal temperature Frequency Tolerance: ±10ppm; Frequency Stability(Full temperature range): ±20ppm
X4 = XOS32012000LT00351005: Frequency:12MHz Normal temperature Frequency Tolerance:±10ppm Normal temperature Frequency Tolerance:±10ppm Output Type:CMOS Voltage - Supply:1.62V~3.63V Voltage - Supply:1.62V~3.63V Current - Supply:5mA Frequency Stability:±20ppm Frequency Stability:±20p; LCSC Part Name: 有源晶振; Supplier Part: C37635414; Manufacturer: 同晶; Supplier Footprint: SMD3225-4P; JLCPCB Part Class: Extended Part; Datasheet: https://atta.szlcsc.com/upload/public/pdf/source/20240731/42FA47FF4539A35ABC12F7AFD71E938E.pdf; Supplier: LCSC; Normal temperature Frequency Tolerance: ±10ppm; Output Type: CMOS; Voltage - Supply: 1.62V~3.63V; Current - Supply: 5mA; Frequency Stability: ±20ppm; Operating Temperature: -40℃~+85℃

## Nets
5VIN: SW13.2 SW13.5 USB2.A4(VBUS) USB2.A9(VBUS) USB2.B4(VBUS) USB2.B9(VBUS)
+5V: C25.2 C67.2 C121.1 C122.1 D1.2(A) D2.1(K) H4.27 SW13.4 SW13.6 U21.3(VIN) U38.6(IN)
AGND: C90.1 C91.1 C92.1 C93.2 C95.1 C96.1 C99.1 CN5.1 L31.2 U27.3(CPGND) U27.9(AGND)
AVDD: C90.2 C91.2 C92.2 C99.2 L30.1 U27.1(CPVDD) U27.8(AVDD)
DVDD: C100.2 C101.2 C115.2 C116.2 U28.10(DVDD) U28.32(DVDD) U28.51(DVDD) U37.5(OUT)
GND: BT6.2 C22.1 C25.1 C26.1 C27.1 C34.2 C35.1 C60.1 C63.2 C66.1 C67.1 C84.2 C85.2 C86.1 C88.1 C89.1 C97.2 C98.2 C100.1 C101.1 C102.1 C103.1 C104.1 C105.1 C106.1 C107.1 C108.1 C109.1 C110.1 C111.1 C112.1 C113.1 C114.1 C115.1 C116.1 C118.1 C119.2 C120.1 C121.2 C122.2 C123.2 C124.1 C126.1 CARD2.6(VSS) CARD2.10 CARD2.11 CARD2.12 CARD2.13 CN8.0 CN8.1 H2.3 H4.1 H4.2 H4.29 HDMI1.2(TMDS_Data2_Shield) HDMI1.5(TMDS_Data1_Shield) HDMI1.8(TMDS_Data0_Shield) HDMI1.11(TMDS_Clock_Shield) HDMI1.17(DDC/CEC_Ground) HDMI1.20(EH) HDMI1.21(EH) HDMI1.22(EH) HDMI1.23(EH) L31.1 LED1.1(-) R31.1 R32.1 R33.1 R101.1 SW13.1 SW13.3 SW15.1 SW15.3 SW15.4 SW22.2 U6.4(GND) U7.1(GND) U19.5(GND) U21.1(GND) U24.1(GND) U27.10(DEMP) U27.11(FLT) U27.12(SCK) U27.16(FMT) U27.19(DGND) U28.62(VREG_PGND) U28.65(VREG_FB) U28.81(GND) U33.4(VSS) U35.1(GND) U35.12(GND) U35.28(GND) U36.1(Ground) U36.4(Ground) U36.7(Ground) U36.11(Ground) U36.15(Ground) U36.21(Ground) U37.2(GND) U38.5(GND) U38.7(EXP) USB2.A1(GND) USB2.A12(GND) USB2.B1(GND) USB2.B12(GND) USB3.4(GND) USB3.8(GND) USB3.9(SHELL) USB3.10(SHELL) USB3.11(SHELL) USB3.12(SHELL) USB4.4(GND) USB4.8(GND) USB4.9(SHELL) USB4.10(SHELL) USB4.11(SHELL) USB4.12(SHELL) USB5.5(GND) USB5.6(SH1) USB5.7(SH2) USB5.8(SH3) USB5.9(SH4) X1.2(GND) X1.4(GND) X4.2(GND)
VBAT: BT6.1 C63.1 U19.6(VBAT)
VCC: ACTIVE.2(A) C22.2 C26.2 C34.1 C60.2 C66.2 C84.1 C86.2 C88.2 C89.2 C102.2 C104.2 C105.2 C106.2 C107.2 C108.2 C109.2 C110.2 C111.2 C112.2 C113.2 C114.2 C126.2 CN8.2 FB1.2 H4.3 H4.4 L30.2 R29.2 R52.2 R53.2 R79.2 R88.1 R94.2 R95.2 R97.2 R98.2 R102.2 U6.8(VCC) U7.4(V3) U7.16(VCC) U19.2(VCC) U19.4(RST#) U21.2(VOUT) U21.4(VOUT) U24.3(VDD) U27.17(XSMT) U27.20(DVDD) U28.5(IOVDD) U28.15(IOVDD) U28.24(IOVDD) U28.29(IOVDD) U28.41(IOVDD) U28.50(IOVDD) U28.59(ADC_AVDD) U28.60(IOVDD) U28.68(USB_OTP_VDD) U28.69(QSPI_IOVDD) U28.76(IOVDD) U33.8(VDD) U35.13(VDD33) U35.20(V5) U35.21(VDD33) U37.1(IN) U37.3(EN) X4.1(TRI-STATE) X4.4(VDD)
VCCBAT: C123.1 C124.2 FB1.1 U36.14(VDDIO) U36.16(Vin)
DM1: U35.10(DM1) USB4.2(D-)
DM2: U35.8(DM2) USB4.6(D-)
DM3: U35.6(DM3) USB3.2(D-)
DM4: U35.4(DM4) USB3.6(D-)
DMU: SW21.3 U35.15(DMU)
DP1: U35.11(DP1) USB4.3(D+)
DP2: U35.9(DP2) USB4.7(D+)
DP3: U35.7(DP3) USB3.3(D+)
DP4: U35.5(DP4) USB3.7(D+)
DPU: SW21.6 U35.16(DPU)
GPIO0: H4.5 U28.77(GPIO0)
GPIO1: H4.6 U28.78(GPIO1)
GPIO2: H4.7 U28.79(GPIO2)
GPIO3: H4.8 U28.80(GPIO3)
GPIO4: H4.9 U28.1(GPIO4)
GPIO5: H4.10 U28.2(GPIO5)
GPIO6: H4.11 U28.3(GPIO6)
GPIO7: H4.12 U28.4(GPIO7)
GPIO8: U7.3(RXD) U28.6(GPIO8)
GPIO9: U7.2(TXD) U28.7(GPIO9)
GPIO10: U27.13(BCK) U28.8(GPIO10)
GPIO11: U27.15(LRCK) U28.9(GPIO11)
GPIO12: R68.1 U28.11(GPIO12)
GPIO13: R67.1 U28.12(GPIO13)
GPIO14: R66.1 U28.13(GPIO14)
GPIO15: R65.1 U28.14(GPIO15)
GPIO16: R64.1 U28.16(GPIO16)
GPIO17: R63.1 U28.17(GPIO17)
GPIO18: R62.1 U28.18(GPIO18)
GPIO19: R61.1 U28.19(GPIO19)
GPIO20: CN8.3 H4.28 R52.1 U19.7(SDA) U28.20(GPIO20)
GPIO21: CN8.4 H4.30 R53.1 U19.8(SCL) U28.21(GPIO21)
GPIO22: U27.14(DIN) U28.22(GPIO22)
GPIO23: U28.23(GPIO23) U36.12(Wi-Fi_on) U36.13(Bluetooth_on)
GPIO24: R90.1 R96.1 U28.25(GPIO24) U36.5(gSPI_Data_In)
GPIO25: H5.1 U28.26(GPIO25) U36.9(gSPICS)
GPIO26: H4.14 U28.27(GPIO26)
GPIO27: R95.1 U19.1(32kHz) U28.28(GPIO27)
GPIO28: CARD2.7(DAT0) U28.36(GPIO28)
GPIO29: U28.37(GPIO29) U36.3(gSPI_SCLK)
GPIO30: CARD2.5(CLX) U28.38(GPIO30)
GPIO31: CARD2.3(CMD) U28.39(GPIO31)
GPIO32: R94.1 U19.3(INT#/SQW) U28.40(GPIO32)
GPIO33: CARD2.2(CD/DAT3) U28.42(GPIO33)
GPIO34: H4.13 U28.43(GPIO34)
GPIO35: H4.16 U28.44(GPIO35)
GPIO36: H4.15 U28.45(GPIO36)
GPIO37: H4.18 U28.46(GPIO37)
GPIO38: H4.17 U28.47(GPIO38)
GPIO39: H4.20 U28.48(GPIO39)
GPIO40: H4.19 U28.49(GPIO40_ADC0)
GPIO41: H4.22 U28.52(GPIO41_ADC1)
GPIO42: H4.21 U28.53(GPIO42_ADC2)
GPIO43: H4.24 U28.54(GPIO43_ADC3)
GPIO44: H4.23 U28.55(GPIO44_ADC4)
GPIO45: H4.26 U28.56(GPIO45_ADC5)
GPIO46: H4.25 U28.57(GPIO46_ADC6)
HEARTBEAT: H5.2 R3.1
LED1: PORT3.1(A) PORT4.2(K) R58.2
LED2: PORT1.1(A) PORT2.2(K) R57.2
LED4: PORT1.2(K) PORT2.1(A) PORT3.2(K) PORT4.1(A) R59.1 U35.22(LED4/SDA)
MDM: SW21.1 USB5.2(D-)
MDP: SW21.4 USB5.3(D+)
OVCUR: R102.1 U35.26(OVCUR#) U38.3(FAULT#)
PSRAM_SS: R97.1 U28.58(GPIO47_ADC7) U33.1(CE#)
PWREN: U35.25(PWREN#) U38.4(EN)
QSPI_SCLK: U6.6(CLK) U28.71(QSPI_SCLK) U33.6(SCLK)
QSPI_SD0: U6.5(DI) U28.72(QSPI_SD0) U33.5(SI/SIO[0])
QSPI_SD1: U6.2(DO) U28.74(QSPI_SD1) U33.2(SO/SIO[1])
QSPI_SD2: U6.3(IO2) U28.73(QSPI_SD2) U33.3(SIO[2])
QSPI_SD3: U6.7(IO3) U28.70(QSPI_SD3) U33.7(SIO[3])
QSPI_SS: R4.1 R98.1 U6.1(CS#) U28.75(QSPI_SS)
RESET: R60.1 SW15.2 U28.35(RUN) U35.17(RESET#/CDP)
SWCLK: H2.1 U28.33(SWCLK)
SWDATA: H2.2 U28.34(SWDIO)
USB-DM: U7.6(D-) USB2.A7(DN1) USB2.B7(DN2)
USB-DP: U7.5(D+) USB2.A6(DP1) USB2.B6(DP2)
USB_HOST_DM: SW21.2 U28.66(USB_DM)
USB_HOST_DP: SW21.5 U28.67(USB_DP)
VREG_AVDD: C35.2 C103.2 L29.1 U28.61(VREG_AVDD)
VREG_VIN: C119.1 R88.2 U28.64(VREG_VIN)
VUSBOUT: C85.1 U38.1(OUT) USB3.1(VCC) USB3.5(VCC) USB4.1(VCC) USB4.5(VCC)
XI: U35.3(XI) X1.3(OSC2)
XO: U35.2(XO) X1.1(OSC1)
$1N1726: C27.2 C120.2 CARD2.4(VDD) R29.1
$1N2125: R31.2 USB2.B5(CC2)
$1N2134: R32.2 USB2.A5(CC1)
$1N2136: R33.2 USB2.1(EP) USB2.2(EP) USB2.3(EP) USB2.4(EP)
$1N6229: R57.1 U35.24(LED2/PGANG)
$1N6268: R58.1 U35.23(LED1/PSELF)
$1N6846: ACTIVE.1(K) R59.2
$1N9100: R60.2 U24.2(RESET)
$1N12629: D1.1(K) HDMI1.18(+5V_Power)
$1N19302: D2.2(A) USB5.1(VBUS)
$1N22005: HDMI1.1(TMDS_Data2+) R61.2
$1N22047: HDMI1.3(TMDS_Data2-) R62.2
$1N22089: HDMI1.4(TMDS_Data1+) R63.2
$1N22131: HDMI1.6(TMDS_Data1-) R64.2
$1N22173: HDMI1.7(TMDS_Data0+) R65.2
$1N22252: HDMI1.10(TMDS_Clock+) R67.2
$1N22294: HDMI1.12(TMDS_Clock-) R68.2
$1N22336: HDMI1.9(TMDS_Data_0-) R66.2
$1N60495: R70.2 U27.6(OUTL)
$1N60497: R69.2 U27.7(OUTR)
$1N60710: C97.1 C98.1 U27.18(LDOO)
$1N61833: C81.1 U27.2(CAPP)
$1N61837: C81.2 U27.4(CAPM)
$1N61903: C93.1 U27.5(VNEG)
$1N62204: C96.2 CN5.2 R69.1
$1N62212: C95.2 CN5.3 R70.1
$1N70083: U28.30(XIN) X4.3(OUT)
$1N70156: LED1.2(+) R3.2
$1N70158: C118.2 L29.2 R79.1
$1N104865: R96.2 U36.10(nIRQ)
$1N104968: R90.2 U36.6(gSPI_Data_out)
$1N117781: H5.3 U36.8(GPIO0)
$1N125756: R101.2 U38.2(ILIM)
$1N130181: R4.2 SW22.1

Not connected (* = marked no-connect by the designer): CARD2 1(DAT2)* 8(DAT1)* CD*; HDMI1 13(CEC)* 14(Reserved(N.C.))* 15(SCL)* 16(SDA)* 19(Hot_Plug_Detect)*; U7 7(NC.)* 8(OUT#)* 9(CTS#)* 10(DSR#)* 11(RI#)* 12(DCD#)* 13(DTR#)* 14(RTS#)* 15(R232)*; U28 31(XOUT)* 63(VREG_LX)*; U35 14(LED3/SCL)* 18(NC)* 19(PSELF)* 27(NC)*; U36 2(nc)* 17(GPIO2)* 18(GPIO1)* 19(nc)* 20(nc)*; U37 4(NC)*; USB2 A8(SUB1)* B8(SUB2)*; USB5 4(ID)*

## Notes on the sheet
- PRIMARY FLASH
- PSRAM
- DVDD SUPPLY
- I2S AUDIO
- POWER
- USB CONSOLE
- USB HUB
- SDCARD
- HDMI
- RTC
- EXTERNAL I/O
- RESET
